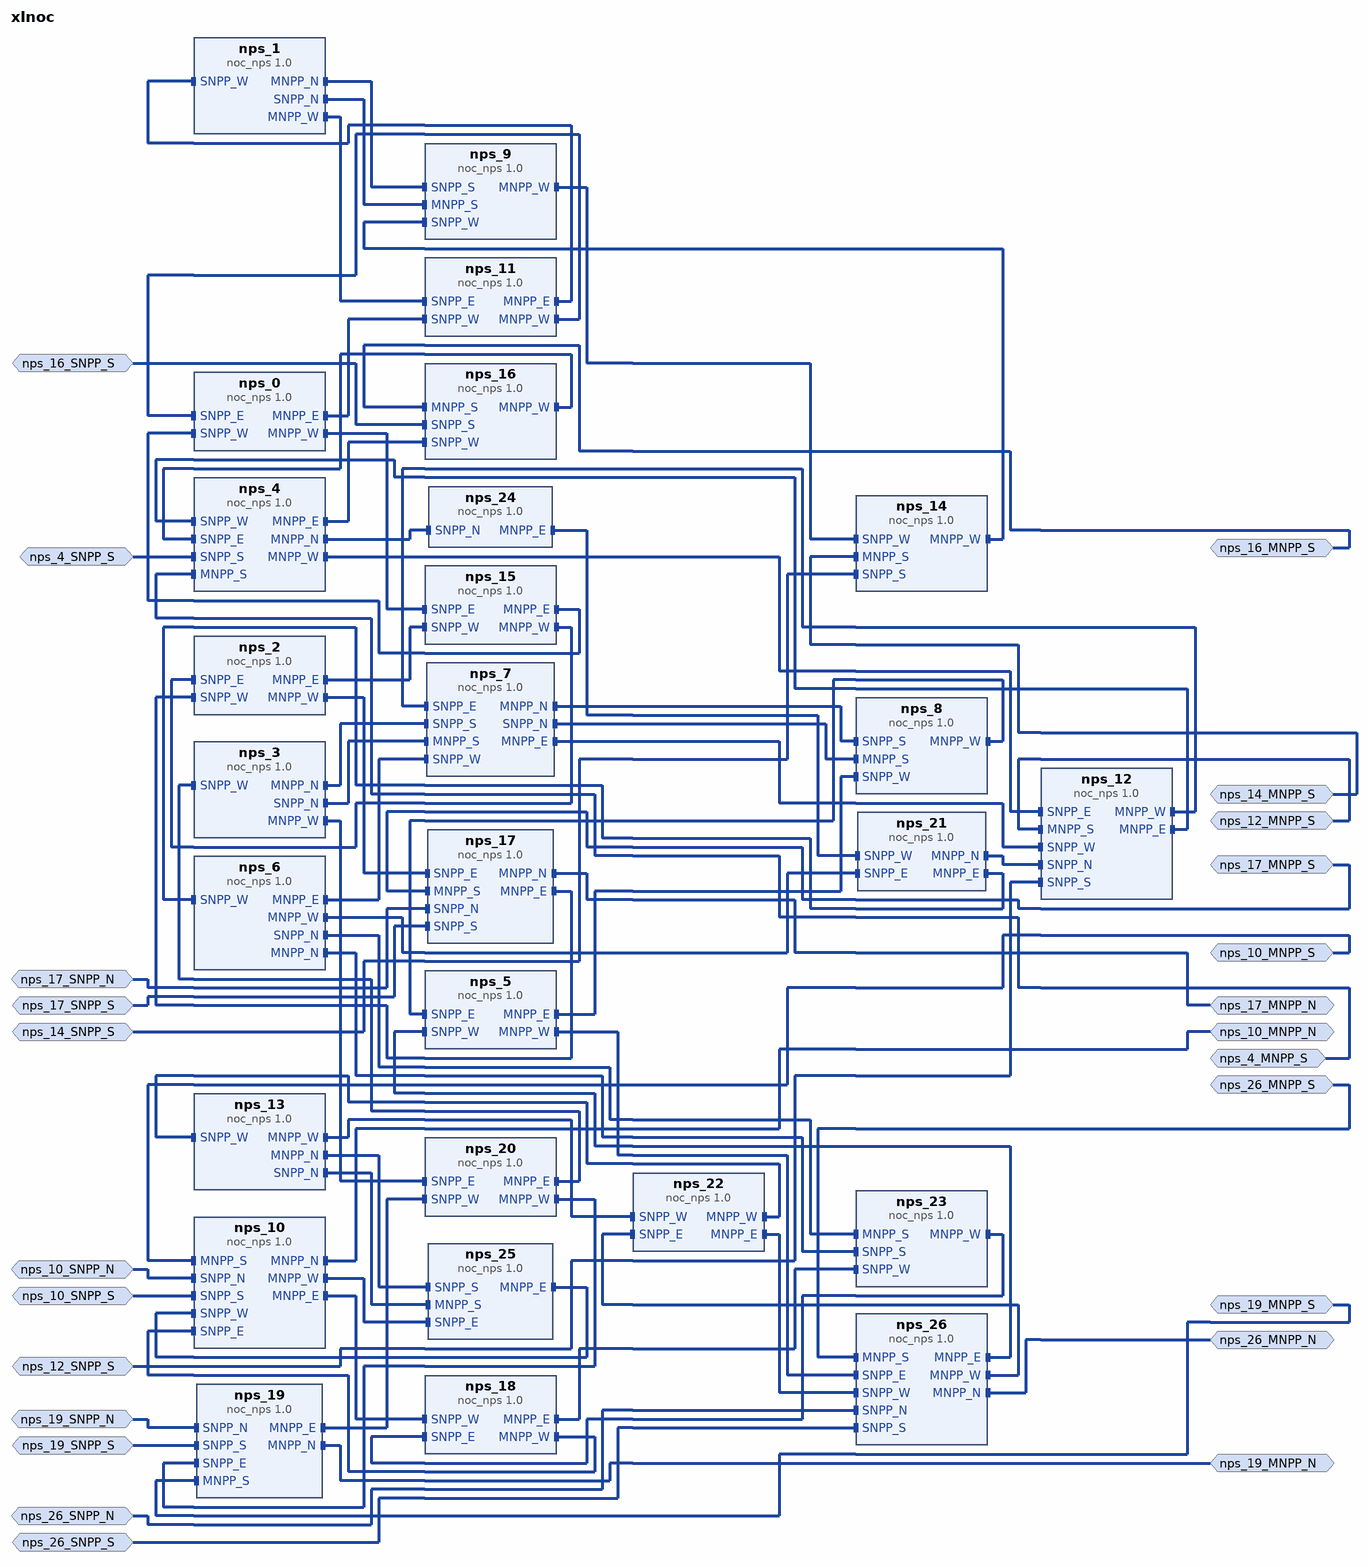
[diagram p0: block diagram of the top level]
# Vivado block design xlnoc, xcvp1802-lsvc4072-2MP-e-S, Vivado 2022.2.2
create_bd_design xlnoc

create_bd_intf_port -mode Slave -vlnv xilinx.com:interface:npp_rtl:1.0 nps_10_SNPP_S
create_bd_intf_port -mode Master -vlnv xilinx.com:interface:npp_rtl:1.0 nps_26_MNPP_S
create_bd_intf_port -mode Slave -vlnv xilinx.com:interface:npp_rtl:1.0 nps_26_SNPP_S
create_bd_intf_port -mode Master -vlnv xilinx.com:interface:npp_rtl:1.0 nps_10_MNPP_S
create_bd_intf_port -mode Slave -vlnv xilinx.com:interface:npp_rtl:1.0 nps_16_SNPP_S
create_bd_intf_port -mode Master -vlnv xilinx.com:interface:npp_rtl:1.0 nps_16_MNPP_S
create_bd_intf_port -mode Slave -vlnv xilinx.com:interface:npp_rtl:1.0 nps_14_SNPP_S
create_bd_intf_port -mode Master -vlnv xilinx.com:interface:npp_rtl:1.0 nps_17_MNPP_N
create_bd_intf_port -mode Slave -vlnv xilinx.com:interface:npp_rtl:1.0 nps_17_SNPP_N
create_bd_intf_port -mode Master -vlnv xilinx.com:interface:npp_rtl:1.0 nps_14_MNPP_S
create_bd_intf_port -mode Slave -vlnv xilinx.com:interface:npp_rtl:1.0 nps_17_SNPP_S
create_bd_intf_port -mode Master -vlnv xilinx.com:interface:npp_rtl:1.0 nps_17_MNPP_S
create_bd_intf_port -mode Slave -vlnv xilinx.com:interface:npp_rtl:1.0 nps_12_SNPP_S
create_bd_intf_port -mode Master -vlnv xilinx.com:interface:npp_rtl:1.0 nps_19_MNPP_S
create_bd_intf_port -mode Slave -vlnv xilinx.com:interface:npp_rtl:1.0 nps_19_SNPP_S
create_bd_intf_port -mode Master -vlnv xilinx.com:interface:npp_rtl:1.0 nps_12_MNPP_S
create_bd_intf_port -mode Slave -vlnv xilinx.com:interface:npp_rtl:1.0 nps_19_SNPP_N
create_bd_intf_port -mode Master -vlnv xilinx.com:interface:npp_rtl:1.0 nps_19_MNPP_N
create_bd_intf_port -mode Slave -vlnv xilinx.com:interface:npp_rtl:1.0 nps_4_SNPP_S
create_bd_intf_port -mode Master -vlnv xilinx.com:interface:npp_rtl:1.0 nps_10_MNPP_N
create_bd_intf_port -mode Slave -vlnv xilinx.com:interface:npp_rtl:1.0 nps_10_SNPP_N
create_bd_intf_port -mode Master -vlnv xilinx.com:interface:npp_rtl:1.0 nps_4_MNPP_S
create_bd_intf_port -mode Slave -vlnv xilinx.com:interface:npp_rtl:1.0 nps_26_SNPP_N
create_bd_intf_port -mode Master -vlnv xilinx.com:interface:npp_rtl:1.0 nps_26_MNPP_N

create_bd_cell -type ip -vlnv xilinx.com:ip:noc_nps:1.0 nps_0
set_property -dict [list \
  CONFIG.USER_MNORTH_PORT_EN FALSE \
  CONFIG.USER_MSOUTH_PORT_EN FALSE \
  CONFIG.USER_SNORTH_PORT_EN FALSE \
  CONFIG.USER_SSOUTH_PORT_EN FALSE \
] [get_bd_cells nps_0]
create_bd_cell -type ip -vlnv xilinx.com:ip:noc_nps:1.0 nps_1
set_property -dict [list \
  CONFIG.USER_MEAST_PORT_EN FALSE \
  CONFIG.USER_MSOUTH_PORT_EN FALSE \
  CONFIG.USER_SEAST_PORT_EN FALSE \
  CONFIG.USER_SSOUTH_PORT_EN FALSE \
] [get_bd_cells nps_1]
create_bd_cell -type ip -vlnv xilinx.com:ip:noc_nps:1.0 nps_2
set_property -dict [list \
  CONFIG.USER_MNORTH_PORT_EN FALSE \
  CONFIG.USER_MSOUTH_PORT_EN FALSE \
  CONFIG.USER_SNORTH_PORT_EN FALSE \
  CONFIG.USER_SSOUTH_PORT_EN FALSE \
] [get_bd_cells nps_2]
create_bd_cell -type ip -vlnv xilinx.com:ip:noc_nps:1.0 nps_3
set_property -dict [list \
  CONFIG.USER_MEAST_PORT_EN FALSE \
  CONFIG.USER_MSOUTH_PORT_EN FALSE \
  CONFIG.USER_SEAST_PORT_EN FALSE \
  CONFIG.USER_SSOUTH_PORT_EN FALSE \
] [get_bd_cells nps_3]
create_bd_cell -type ip -vlnv xilinx.com:ip:noc_nps:1.0 nps_4
set_property -dict {CONFIG.USER_SNORTH_PORT_EN FALSE} [get_bd_cells nps_4]
create_bd_cell -type ip -vlnv xilinx.com:ip:noc_nps:1.0 nps_5
set_property -dict [list \
  CONFIG.USER_MNORTH_PORT_EN FALSE \
  CONFIG.USER_MSOUTH_PORT_EN FALSE \
  CONFIG.USER_SNORTH_PORT_EN FALSE \
  CONFIG.USER_SSOUTH_PORT_EN FALSE \
] [get_bd_cells nps_5]
create_bd_cell -type ip -vlnv xilinx.com:ip:noc_nps:1.0 nps_6
set_property -dict [list \
  CONFIG.USER_MSOUTH_PORT_EN FALSE \
  CONFIG.USER_SEAST_PORT_EN FALSE \
  CONFIG.USER_SSOUTH_PORT_EN FALSE \
] [get_bd_cells nps_6]
create_bd_cell -type ip -vlnv xilinx.com:ip:noc_nps:1.0 nps_7
set_property -dict {CONFIG.USER_MWEST_PORT_EN FALSE} [get_bd_cells nps_7]
create_bd_cell -type ip -vlnv xilinx.com:ip:noc_nps:1.0 nps_8
set_property -dict [list \
  CONFIG.USER_MEAST_PORT_EN FALSE \
  CONFIG.USER_MNORTH_PORT_EN FALSE \
  CONFIG.USER_SEAST_PORT_EN FALSE \
  CONFIG.USER_SNORTH_PORT_EN FALSE \
] [get_bd_cells nps_8]
create_bd_cell -type ip -vlnv xilinx.com:ip:noc_nps:1.0 nps_9
set_property -dict [list \
  CONFIG.USER_MEAST_PORT_EN FALSE \
  CONFIG.USER_MNORTH_PORT_EN FALSE \
  CONFIG.USER_SEAST_PORT_EN FALSE \
  CONFIG.USER_SNORTH_PORT_EN FALSE \
] [get_bd_cells nps_9]
create_bd_cell -type ip -vlnv xilinx.com:ip:noc_nps:1.0 nps_10
create_bd_cell -type ip -vlnv xilinx.com:ip:noc_nps:1.0 nps_11
set_property -dict [list \
  CONFIG.USER_MNORTH_PORT_EN FALSE \
  CONFIG.USER_MSOUTH_PORT_EN FALSE \
  CONFIG.USER_SNORTH_PORT_EN FALSE \
  CONFIG.USER_SSOUTH_PORT_EN FALSE \
] [get_bd_cells nps_11]
create_bd_cell -type ip -vlnv xilinx.com:ip:noc_nps:1.0 nps_12
set_property -dict {CONFIG.USER_MNORTH_PORT_EN FALSE} [get_bd_cells nps_12]
create_bd_cell -type ip -vlnv xilinx.com:ip:noc_nps:1.0 nps_13
set_property -dict [list \
  CONFIG.USER_MEAST_PORT_EN FALSE \
  CONFIG.USER_MSOUTH_PORT_EN FALSE \
  CONFIG.USER_SEAST_PORT_EN FALSE \
  CONFIG.USER_SSOUTH_PORT_EN FALSE \
] [get_bd_cells nps_13]
create_bd_cell -type ip -vlnv xilinx.com:ip:noc_nps:1.0 nps_14
set_property -dict [list \
  CONFIG.USER_MEAST_PORT_EN FALSE \
  CONFIG.USER_MNORTH_PORT_EN FALSE \
  CONFIG.USER_SEAST_PORT_EN FALSE \
  CONFIG.USER_SNORTH_PORT_EN FALSE \
] [get_bd_cells nps_14]
create_bd_cell -type ip -vlnv xilinx.com:ip:noc_nps:1.0 nps_15
set_property -dict [list \
  CONFIG.USER_MNORTH_PORT_EN FALSE \
  CONFIG.USER_MSOUTH_PORT_EN FALSE \
  CONFIG.USER_SNORTH_PORT_EN FALSE \
  CONFIG.USER_SSOUTH_PORT_EN FALSE \
] [get_bd_cells nps_15]
create_bd_cell -type ip -vlnv xilinx.com:ip:noc_nps:1.0 nps_16
set_property -dict [list \
  CONFIG.USER_MEAST_PORT_EN FALSE \
  CONFIG.USER_MNORTH_PORT_EN FALSE \
  CONFIG.USER_SEAST_PORT_EN FALSE \
  CONFIG.USER_SNORTH_PORT_EN FALSE \
] [get_bd_cells nps_16]
create_bd_cell -type ip -vlnv xilinx.com:ip:noc_nps:1.0 nps_17
set_property -dict {CONFIG.USER_MWEST_PORT_EN FALSE CONFIG.USER_SWEST_PORT_EN FALSE} [get_bd_cells nps_17]
create_bd_cell -type ip -vlnv xilinx.com:ip:noc_nps:1.0 nps_18
set_property -dict [list \
  CONFIG.USER_MNORTH_PORT_EN FALSE \
  CONFIG.USER_MSOUTH_PORT_EN FALSE \
  CONFIG.USER_SNORTH_PORT_EN FALSE \
  CONFIG.USER_SSOUTH_PORT_EN FALSE \
] [get_bd_cells nps_18]
create_bd_cell -type ip -vlnv xilinx.com:ip:noc_nps:1.0 nps_19
set_property -dict {CONFIG.USER_MWEST_PORT_EN FALSE CONFIG.USER_SWEST_PORT_EN FALSE} [get_bd_cells nps_19]
create_bd_cell -type ip -vlnv xilinx.com:ip:noc_nps:1.0 nps_20
set_property -dict [list \
  CONFIG.USER_MNORTH_PORT_EN FALSE \
  CONFIG.USER_MSOUTH_PORT_EN FALSE \
  CONFIG.USER_SNORTH_PORT_EN FALSE \
  CONFIG.USER_SSOUTH_PORT_EN FALSE \
] [get_bd_cells nps_20]
create_bd_cell -type ip -vlnv xilinx.com:ip:noc_nps:1.0 nps_21
set_property -dict [list \
  CONFIG.USER_MSOUTH_PORT_EN FALSE \
  CONFIG.USER_MWEST_PORT_EN FALSE \
  CONFIG.USER_SNORTH_PORT_EN FALSE \
  CONFIG.USER_SSOUTH_PORT_EN FALSE \
] [get_bd_cells nps_21]
create_bd_cell -type ip -vlnv xilinx.com:ip:noc_nps:1.0 nps_22
set_property -dict [list \
  CONFIG.USER_MNORTH_PORT_EN FALSE \
  CONFIG.USER_MSOUTH_PORT_EN FALSE \
  CONFIG.USER_SNORTH_PORT_EN FALSE \
  CONFIG.USER_SSOUTH_PORT_EN FALSE \
] [get_bd_cells nps_22]
create_bd_cell -type ip -vlnv xilinx.com:ip:noc_nps:1.0 nps_23
set_property -dict [list \
  CONFIG.USER_MEAST_PORT_EN FALSE \
  CONFIG.USER_MNORTH_PORT_EN FALSE \
  CONFIG.USER_SEAST_PORT_EN FALSE \
  CONFIG.USER_SNORTH_PORT_EN FALSE \
] [get_bd_cells nps_23]
create_bd_cell -type ip -vlnv xilinx.com:ip:noc_nps:1.0 nps_24
set_property -dict [list \
  CONFIG.USER_MNORTH_PORT_EN FALSE \
  CONFIG.USER_MSOUTH_PORT_EN FALSE \
  CONFIG.USER_MWEST_PORT_EN FALSE \
  CONFIG.USER_SEAST_PORT_EN FALSE \
  CONFIG.USER_SSOUTH_PORT_EN FALSE \
  CONFIG.USER_SWEST_PORT_EN FALSE \
] [get_bd_cells nps_24]
create_bd_cell -type ip -vlnv xilinx.com:ip:noc_nps:1.0 nps_25
set_property -dict [list \
  CONFIG.USER_MNORTH_PORT_EN FALSE \
  CONFIG.USER_MWEST_PORT_EN FALSE \
  CONFIG.USER_SNORTH_PORT_EN FALSE \
  CONFIG.USER_SWEST_PORT_EN FALSE \
] [get_bd_cells nps_25]
create_bd_cell -type ip -vlnv xilinx.com:ip:noc_nps:1.0 nps_26

# ---- connections ----

connect_bd_intf_net [get_bd_intf_pins nps_0/MNPP_E] [get_bd_intf_pins nps_11/SNPP_W]
connect_bd_intf_net [get_bd_intf_pins nps_0/MNPP_W] [get_bd_intf_pins nps_15/SNPP_E]
connect_bd_intf_net [get_bd_intf_pins nps_10/MNPP_E] [get_bd_intf_pins nps_18/SNPP_W]
connect_bd_intf_net [get_bd_intf_ports nps_10_MNPP_N] [get_bd_intf_pins nps_10/MNPP_N]
connect_bd_intf_net [get_bd_intf_ports nps_10_MNPP_S] [get_bd_intf_pins nps_10/MNPP_S]
connect_bd_intf_net [get_bd_intf_pins nps_10/MNPP_W] [get_bd_intf_pins nps_25/SNPP_E]
connect_bd_intf_net [get_bd_intf_ports nps_10_SNPP_N] [get_bd_intf_pins nps_10/SNPP_N]
connect_bd_intf_net [get_bd_intf_ports nps_10_SNPP_S] [get_bd_intf_pins nps_10/SNPP_S]
connect_bd_intf_net [get_bd_intf_pins nps_11/MNPP_E] [get_bd_intf_pins nps_1/SNPP_W]
connect_bd_intf_net [get_bd_intf_pins nps_11/MNPP_W] [get_bd_intf_pins nps_0/SNPP_E]
connect_bd_intf_net [get_bd_intf_pins nps_12/MNPP_E] [get_bd_intf_pins nps_4/SNPP_W]
connect_bd_intf_net [get_bd_intf_ports nps_12_MNPP_S] [get_bd_intf_pins nps_12/MNPP_S]
connect_bd_intf_net [get_bd_intf_pins nps_12/MNPP_W] [get_bd_intf_pins nps_7/SNPP_E]
connect_bd_intf_net [get_bd_intf_ports nps_12_SNPP_S] [get_bd_intf_pins nps_12/SNPP_S]
connect_bd_intf_net [get_bd_intf_pins nps_13/MNPP_N] [get_bd_intf_pins nps_25/SNPP_S]
connect_bd_intf_net [get_bd_intf_pins nps_13/MNPP_W] [get_bd_intf_pins nps_22/SNPP_W]
connect_bd_intf_net [get_bd_intf_ports nps_14_MNPP_S] [get_bd_intf_pins nps_14/MNPP_S]
connect_bd_intf_net [get_bd_intf_pins nps_14/MNPP_W] [get_bd_intf_pins nps_9/SNPP_W]
connect_bd_intf_net [get_bd_intf_ports nps_14_SNPP_S] [get_bd_intf_pins nps_14/SNPP_S]
connect_bd_intf_net [get_bd_intf_pins nps_15/MNPP_E] [get_bd_intf_pins nps_0/SNPP_W]
connect_bd_intf_net [get_bd_intf_pins nps_15/MNPP_W] [get_bd_intf_pins nps_2/SNPP_E]
connect_bd_intf_net [get_bd_intf_ports nps_16_MNPP_S] [get_bd_intf_pins nps_16/MNPP_S]
connect_bd_intf_net [get_bd_intf_pins nps_16/MNPP_W] [get_bd_intf_pins nps_4/SNPP_E]
connect_bd_intf_net [get_bd_intf_ports nps_16_SNPP_S] [get_bd_intf_pins nps_16/SNPP_S]
connect_bd_intf_net [get_bd_intf_pins nps_17/MNPP_E] [get_bd_intf_pins nps_2/SNPP_W]
connect_bd_intf_net [get_bd_intf_ports nps_17_MNPP_N] [get_bd_intf_pins nps_17/MNPP_N]
connect_bd_intf_net [get_bd_intf_ports nps_17_MNPP_S] [get_bd_intf_pins nps_17/MNPP_S]
connect_bd_intf_net [get_bd_intf_ports nps_17_SNPP_N] [get_bd_intf_pins nps_17/SNPP_N]
connect_bd_intf_net [get_bd_intf_ports nps_17_SNPP_S] [get_bd_intf_pins nps_17/SNPP_S]
connect_bd_intf_net [get_bd_intf_pins nps_18/MNPP_E] [get_bd_intf_pins nps_23/SNPP_W]
connect_bd_intf_net [get_bd_intf_pins nps_18/MNPP_W] [get_bd_intf_pins nps_10/SNPP_E]
connect_bd_intf_net [get_bd_intf_pins nps_19/MNPP_E] [get_bd_intf_pins nps_20/SNPP_W]
connect_bd_intf_net [get_bd_intf_ports nps_19_MNPP_N] [get_bd_intf_pins nps_19/MNPP_N]
connect_bd_intf_net [get_bd_intf_ports nps_19_MNPP_S] [get_bd_intf_pins nps_19/MNPP_S]
connect_bd_intf_net [get_bd_intf_ports nps_19_SNPP_N] [get_bd_intf_pins nps_19/SNPP_N]
connect_bd_intf_net [get_bd_intf_ports nps_19_SNPP_S] [get_bd_intf_pins nps_19/SNPP_S]
connect_bd_intf_net [get_bd_intf_pins nps_1/MNPP_N] [get_bd_intf_pins nps_9/SNPP_S]
connect_bd_intf_net [get_bd_intf_pins nps_1/MNPP_W] [get_bd_intf_pins nps_11/SNPP_E]
connect_bd_intf_net [get_bd_intf_pins nps_20/MNPP_E] [get_bd_intf_pins nps_3/SNPP_W]
connect_bd_intf_net [get_bd_intf_pins nps_20/MNPP_W] [get_bd_intf_pins nps_19/SNPP_E]
connect_bd_intf_net [get_bd_intf_pins nps_21/MNPP_E] [get_bd_intf_pins nps_6/SNPP_W]
connect_bd_intf_net [get_bd_intf_pins nps_21/MNPP_N] [get_bd_intf_pins nps_12/SNPP_N]
connect_bd_intf_net [get_bd_intf_pins nps_22/MNPP_E] [get_bd_intf_pins nps_26/SNPP_W]
connect_bd_intf_net [get_bd_intf_pins nps_22/MNPP_W] [get_bd_intf_pins nps_13/SNPP_W]
connect_bd_intf_net [get_bd_intf_pins nps_23/MNPP_S] [get_bd_intf_pins nps_6/SNPP_N]
connect_bd_intf_net [get_bd_intf_pins nps_23/MNPP_W] [get_bd_intf_pins nps_18/SNPP_E]
connect_bd_intf_net [get_bd_intf_pins nps_24/MNPP_E] [get_bd_intf_pins nps_21/SNPP_W]
connect_bd_intf_net [get_bd_intf_pins nps_25/MNPP_E] [get_bd_intf_pins nps_10/SNPP_W]
connect_bd_intf_net [get_bd_intf_pins nps_25/MNPP_S] [get_bd_intf_pins nps_13/SNPP_N]
connect_bd_intf_net [get_bd_intf_pins nps_26/MNPP_E] [get_bd_intf_pins nps_5/SNPP_W]
connect_bd_intf_net [get_bd_intf_ports nps_26_MNPP_N] [get_bd_intf_pins nps_26/MNPP_N]
connect_bd_intf_net [get_bd_intf_ports nps_26_MNPP_S] [get_bd_intf_pins nps_26/MNPP_S]
connect_bd_intf_net [get_bd_intf_pins nps_26/MNPP_W] [get_bd_intf_pins nps_22/SNPP_E]
connect_bd_intf_net [get_bd_intf_ports nps_26_SNPP_N] [get_bd_intf_pins nps_26/SNPP_N]
connect_bd_intf_net [get_bd_intf_ports nps_26_SNPP_S] [get_bd_intf_pins nps_26/SNPP_S]
connect_bd_intf_net [get_bd_intf_pins nps_2/MNPP_E] [get_bd_intf_pins nps_15/SNPP_W]
connect_bd_intf_net [get_bd_intf_pins nps_2/MNPP_W] [get_bd_intf_pins nps_17/SNPP_E]
connect_bd_intf_net [get_bd_intf_pins nps_3/MNPP_N] [get_bd_intf_pins nps_7/SNPP_S]
connect_bd_intf_net [get_bd_intf_pins nps_3/MNPP_W] [get_bd_intf_pins nps_20/SNPP_E]
connect_bd_intf_net [get_bd_intf_pins nps_4/MNPP_E] [get_bd_intf_pins nps_16/SNPP_W]
connect_bd_intf_net [get_bd_intf_pins nps_4/MNPP_N] [get_bd_intf_pins nps_24/SNPP_N]
connect_bd_intf_net [get_bd_intf_ports nps_4_MNPP_S] [get_bd_intf_pins nps_4/MNPP_S]
connect_bd_intf_net [get_bd_intf_pins nps_4/MNPP_W] [get_bd_intf_pins nps_12/SNPP_E]
connect_bd_intf_net [get_bd_intf_ports nps_4_SNPP_S] [get_bd_intf_pins nps_4/SNPP_S]
connect_bd_intf_net [get_bd_intf_pins nps_5/MNPP_E] [get_bd_intf_pins nps_8/SNPP_W]
connect_bd_intf_net [get_bd_intf_pins nps_5/MNPP_W] [get_bd_intf_pins nps_26/SNPP_E]
connect_bd_intf_net [get_bd_intf_pins nps_6/MNPP_E] [get_bd_intf_pins nps_7/SNPP_W]
connect_bd_intf_net [get_bd_intf_pins nps_6/MNPP_N] [get_bd_intf_pins nps_23/SNPP_S]
connect_bd_intf_net [get_bd_intf_pins nps_6/MNPP_W] [get_bd_intf_pins nps_21/SNPP_E]
connect_bd_intf_net [get_bd_intf_pins nps_7/MNPP_E] [get_bd_intf_pins nps_12/SNPP_W]
connect_bd_intf_net [get_bd_intf_pins nps_7/MNPP_N] [get_bd_intf_pins nps_8/SNPP_S]
connect_bd_intf_net [get_bd_intf_pins nps_7/MNPP_S] [get_bd_intf_pins nps_3/SNPP_N]
connect_bd_intf_net [get_bd_intf_pins nps_8/MNPP_S] [get_bd_intf_pins nps_7/SNPP_N]
connect_bd_intf_net [get_bd_intf_pins nps_8/MNPP_W] [get_bd_intf_pins nps_5/SNPP_E]
connect_bd_intf_net [get_bd_intf_pins nps_9/MNPP_S] [get_bd_intf_pins nps_1/SNPP_N]
connect_bd_intf_net [get_bd_intf_pins nps_9/MNPP_W] [get_bd_intf_pins nps_14/SNPP_W]

validate_bd_design
save_bd_design
